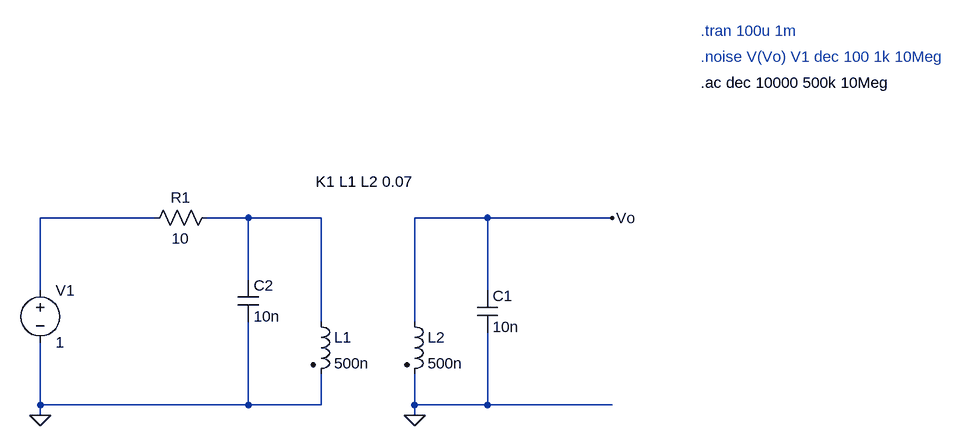
[diagram p0: schematic 2024-10-21_resonant-coils.asc]
2024-10-21_resonant-coils.asc, the LTspice schematic file:
Version 4
SHEET 1 2212 1372
WIRE 672 960 496 960
WIRE 816 960 752 960
WIRE 928 960 816 960
WIRE 1184 960 1072 960
WIRE 1376 960 1184 960
WIRE 816 1056 816 960
WIRE 496 1072 496 960
WIRE 1184 1072 1184 960
WIRE 928 1120 928 960
WIRE 1072 1120 1072 960
WIRE 496 1248 496 1152
WIRE 816 1248 816 1120
WIRE 816 1248 496 1248
WIRE 928 1248 928 1200
WIRE 928 1248 816 1248
WIRE 1072 1248 1072 1200
WIRE 1184 1248 1184 1136
WIRE 1184 1248 1072 1248
WIRE 1376 1248 1184 1248
WIRE 496 1264 496 1248
WIRE 1072 1264 1072 1248
FLAG 1376 960 Vo
FLAG 496 1264 0
FLAG 1072 1264 0
SYMBOL ind2 912 1104 R0
SYMATTR InstName L1
SYMATTR Value 500n
SYMATTR Type ind
SYMATTR SpiceLine Rser=1
SYMBOL ind2 1056 1104 R0
SYMATTR InstName L2
SYMATTR Value 500n
SYMATTR Type ind
SYMATTR SpiceLine Rser=1
SYMBOL Cap 1168 1072 R0
SYMATTR InstName C1
SYMATTR Value 10n
SYMBOL Voltage 496 1056 R0
SYMATTR InstName V1
SYMATTR Value 1
SYMATTR Value2 AC 1
SYMBOL Res 768 944 R90
WINDOW 0 0 56 VBottom 2
WINDOW 3 32 56 VTop 2
SYMATTR InstName R1
SYMATTR Value 10
SYMBOL Cap 800 1056 R0
SYMATTR InstName C2
SYMATTR Value 10n
TEXT 1512 752 Left 2 !.ac dec 10000 500k 10Meg
TEXT 1512 712 Left 2 ;.noise V(Vo) V1 dec 100 1k 10Meg
TEXT 1512 672 Left 2 ;.tran 100u 1m
TEXT 920 904 Left 2 !K1 L1 L2 0.07

The netlist it stands for:
* 2024-10-21_resonant-coils.asc
L1 N002 0 500n Rser=1
L2 Vo 0 500n Rser=1
C1 Vo 0 10n
V1 N001 0 1 AC 1
R1 N002 N001 10
C2 N002 0 10n
.ac dec 10000 500k 10Meg
* .noise V(Vo) V1 dec 100 1k 10Meg
* .tran 100u 1m
K1 L1 L2 0.07
.backanno
.end